# EAGLE design Potencia (EAGLE 9.4.2)
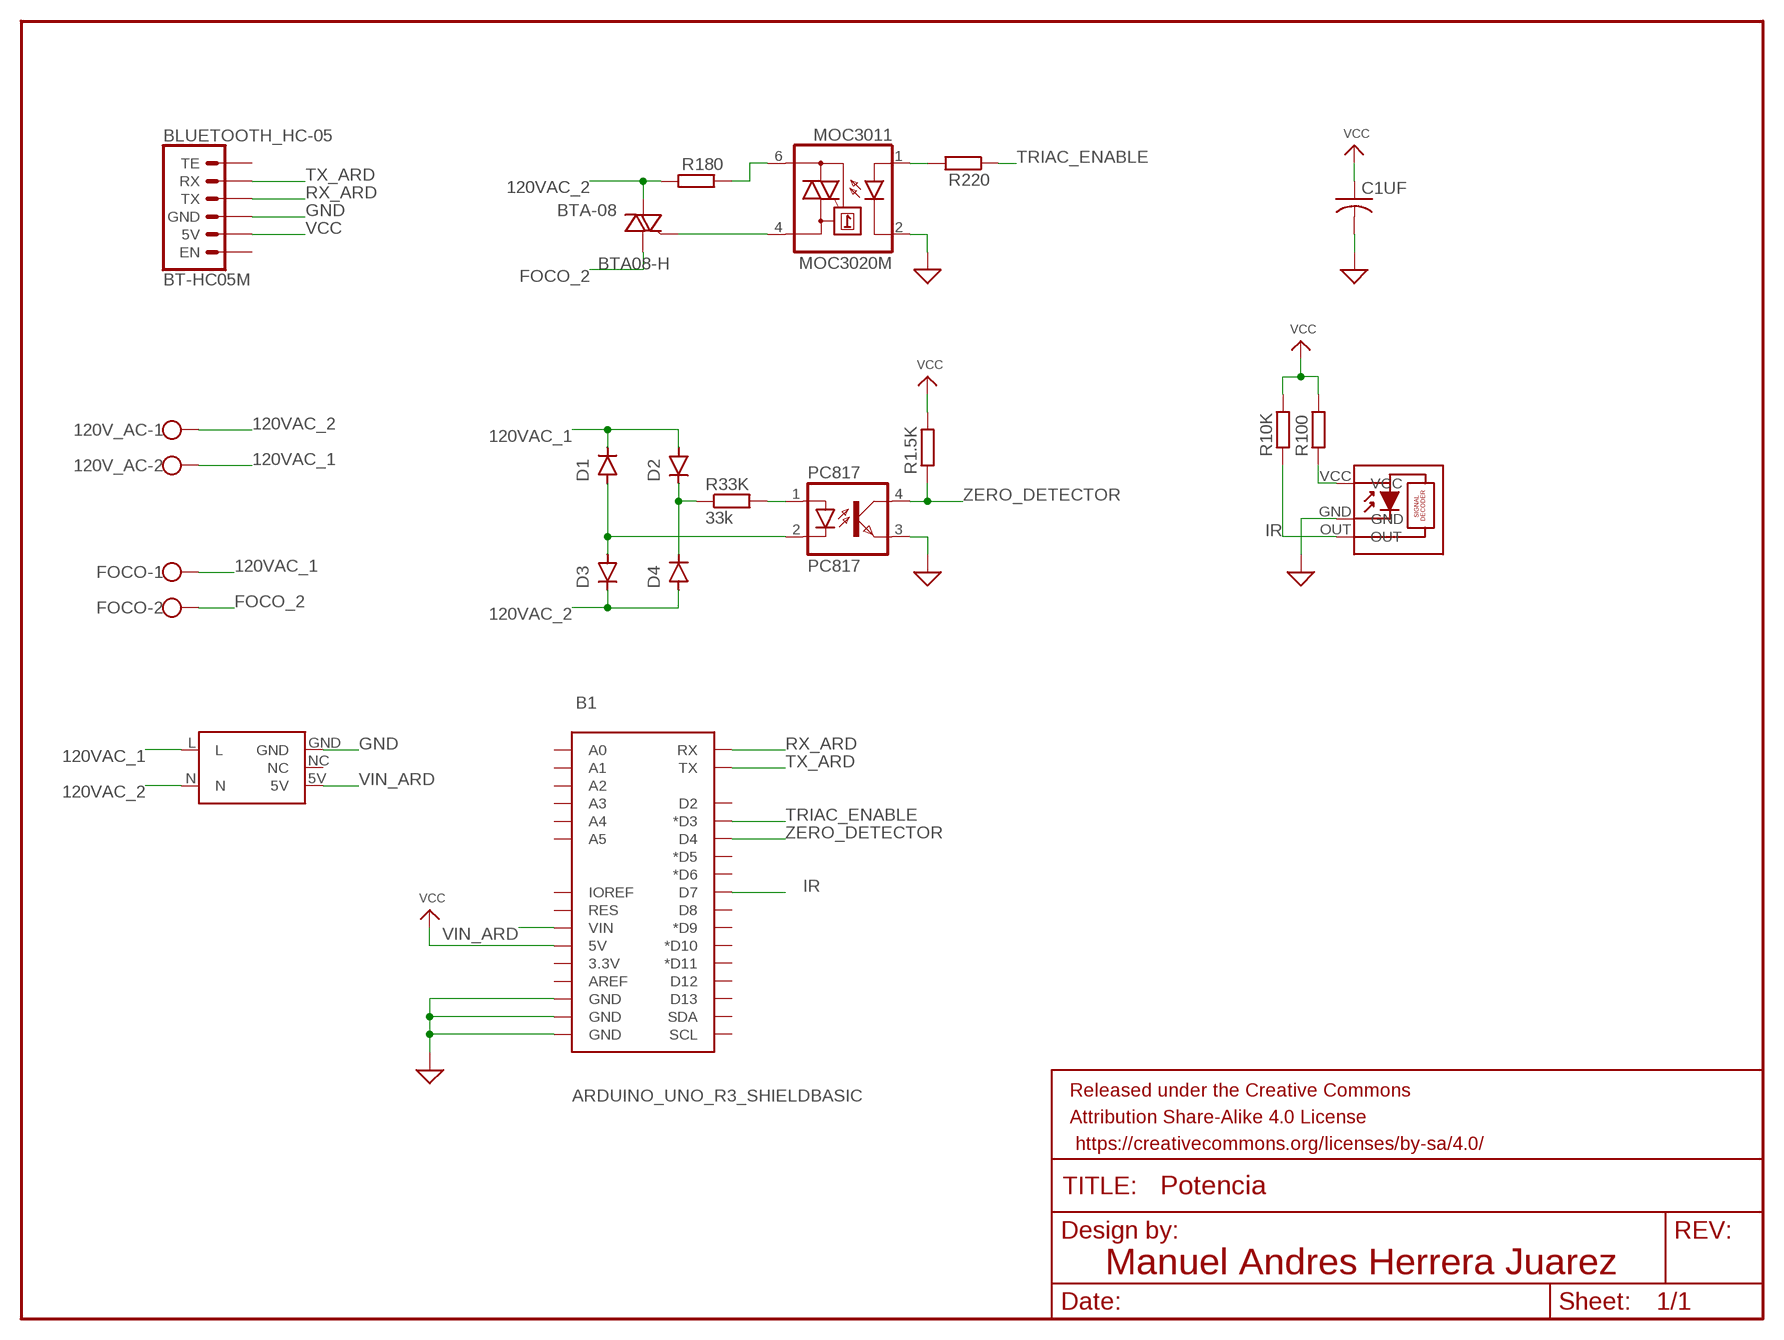
[diagram p0: schematic, sheet 1]

## Parts
120V_AC  W237-102  [W237-102]
B1  ARDUINO_UNO_R3_SHIELDBASIC  [UNO_R3_SHIELD]
BLUETOOTH_HC-05  BT-HC05M  [HEADER1X6]
BTA-08  BTA08-H  [TO220BH]
C1UF  C-USC1206  [C1206]
D1  1N4007  [DO-41]
D2  1N4007  [DO-41]
D3  1N4007  [DO-41]
D4  1N4007  [DO-41]
FOCO  W237-102  [W237-102]
FRAME2  FRAME-LETTERNO_PACKAGE  [DUMMY]
IR1838  VS138  [TO92-BCE]
MOC3011  MOC3020M  [DIL06]
PC817  PC817  [DIL04]
R1.5K  R-EU_0207/10  [0207/10]
R10K  R-EU_0207/10  [0207/10]
R33K  33k  R-EU_0411/15  [0411/15]
R100  R-EU_0207/10  [0207/10]
R180  R-EU_0204/7  [0204/7]
R220  R-EU_0207/10  [0207/10]
U$1  127VAC_5VDC_CONVERTER  [127AC_5DC_CONVERTER]

## Nets
120VAC_1: 120V_AC.2 D1.C D2.A FOCO.1 U$1.L
120VAC_2: 120V_AC.1 BTA-08.T2(A2) D3.C D4.A R180.2 U$1.N
FOCO_2: BTA-08.T1(A1) FOCO.2
GND: B1.GND@0(GND) B1.GND@1(GND) B1.GND@2(GND) BLUETOOTH_HC-05.P$4(GND) C1UF.2 IR1838.GND MOC3011.2(C) PC817.3(EMIT) U$1.GND ; supply symbol labelled SUP
IR: B1.D7 IR1838.OUT R10K.1
N$1: D1.A D3.A PC817.2(C)
N$2: D2.C D4.C R33K.1
N$3: IR1838.VCC R100.1
N$5: PC817.1(A) R33K.2
N$10: BTA-08.G MOC3011.4(A1)
N$12: MOC3011.6(A2) R180.1
N$13: MOC3011.1(A) R220.2
RX_ARD: B1.RX BLUETOOTH_HC-05.P$3(TX)
TRIAC_ENABLE: B1.D3(*D3) R220.1
TX_ARD: B1.TX BLUETOOTH_HC-05.P$2(RX)
VCC: B1.5V BLUETOOTH_HC-05.P$5(5V) C1UF.1 R1.5K.2 R10K.2 R100.2
VIN_ARD: B1.VIN U$1.5V
ZERO_DETECTOR: B1.D4 PC817.4(COL) R1.5K.1
Unconnected: B1.3.3V B1.A0 B1.A1 B1.A2 B1.A3 B1.A4 B1.A5 B1.AREF B1.D2 B1.D5(*D5) B1.D6(*D6) B1.D8 B1.D9(*D9) B1.D10(*D10) B1.D11(*D11) B1.D12 B1.D13 B1.IOREF B1.RES B1.SCL B1.SDA BLUETOOTH_HC-05.P$1(TE) BLUETOOTH_HC-05.P$6(EN) U$1.NC

## Notes on the sheet
- Manuel Andres Herrera Juarez

## Library data of the parts
120V_AC FOCO = con-wago-500:W237-102: WAGO SCREW CLAMP; MPN: 237-102; OC_FARNELL: unknown; OC_NEWARK: 70K9898
B1 = SparkFun-Boards:ARDUINO_UNO_R3_SHIELD: Arduino R3 Shield Footprint Shield form compatible with the Arduino Uno R3. SparkFun Products: MG2639 Cellular Shield <https://www.sparkfun.com/products/13120> MIDI Shield <https://www.sparkfun.com/products/12898> R3 Stackable Headers Kit <https://www.sparkfun.com/products/11417>
BLUETOOTH_HC-05 = MyLibrary:BT-HC05M
BTA-08 = MyLibrary:BTA08: TRIAC Source: http://www.semiconductors.philips.com BT138_SERIES_2.pdf
C1UF = rcl:C-US: CAPACITOR, American symbol; SPICEPREFIX: C
D1-D4 = Diodes:1N4007: DIODE GEN PURP 1KV 1A DO41 Manufacturer's datasheet <https://www.mccsemi.com/pdf/Products/1N4001-1N4007(DO-41).pdf>; CREATED_BY: PCBLayout.com; DIGIKEY_PART_NUMBER: 1N4007MSCT-ND; MANUFACTURER: Micro Commercial Co; MPN: 1N4007; PACKAGE: DO-41
FRAME2 = SparkFun-Aesthetics:FRAME-LETTER: Schematic Frame - Letter Standard 8.5x11 US Letter frame; DESIGNER: Nobody; VERSION: v01
IR1838 = MyLibrary:VS138
MOC3011 = optocoupler:MOC30*M: RANDOM-PHASE OPTOISOLATORS TRIAC DRIVER OUTPUT Source: http://www.fairchildsemi.com MOC3020-M.pdf; MF: FAIRCHILD SEMICONDUCTOR; MPN: MOC3020-M; OC_FARNELL: 1505425; OC_NEWARK: 72K8895
PC817 = optocoupler:PC817: SHARP OPTO COUPLER; MPN: PC817X4J000F; OC_FARNELL: 9707727; OC_NEWARK: 97K7059
R1.5K R10K R33K R100 = resistor:R-EU_: RESISTOR, European symbol
R180 R220 = rcl:R-EU_: RESISTOR, European symbol; SPICEPREFIX: R
U$1 = MyLibrary:127VAC_5VDC_CONVERTER

## Board
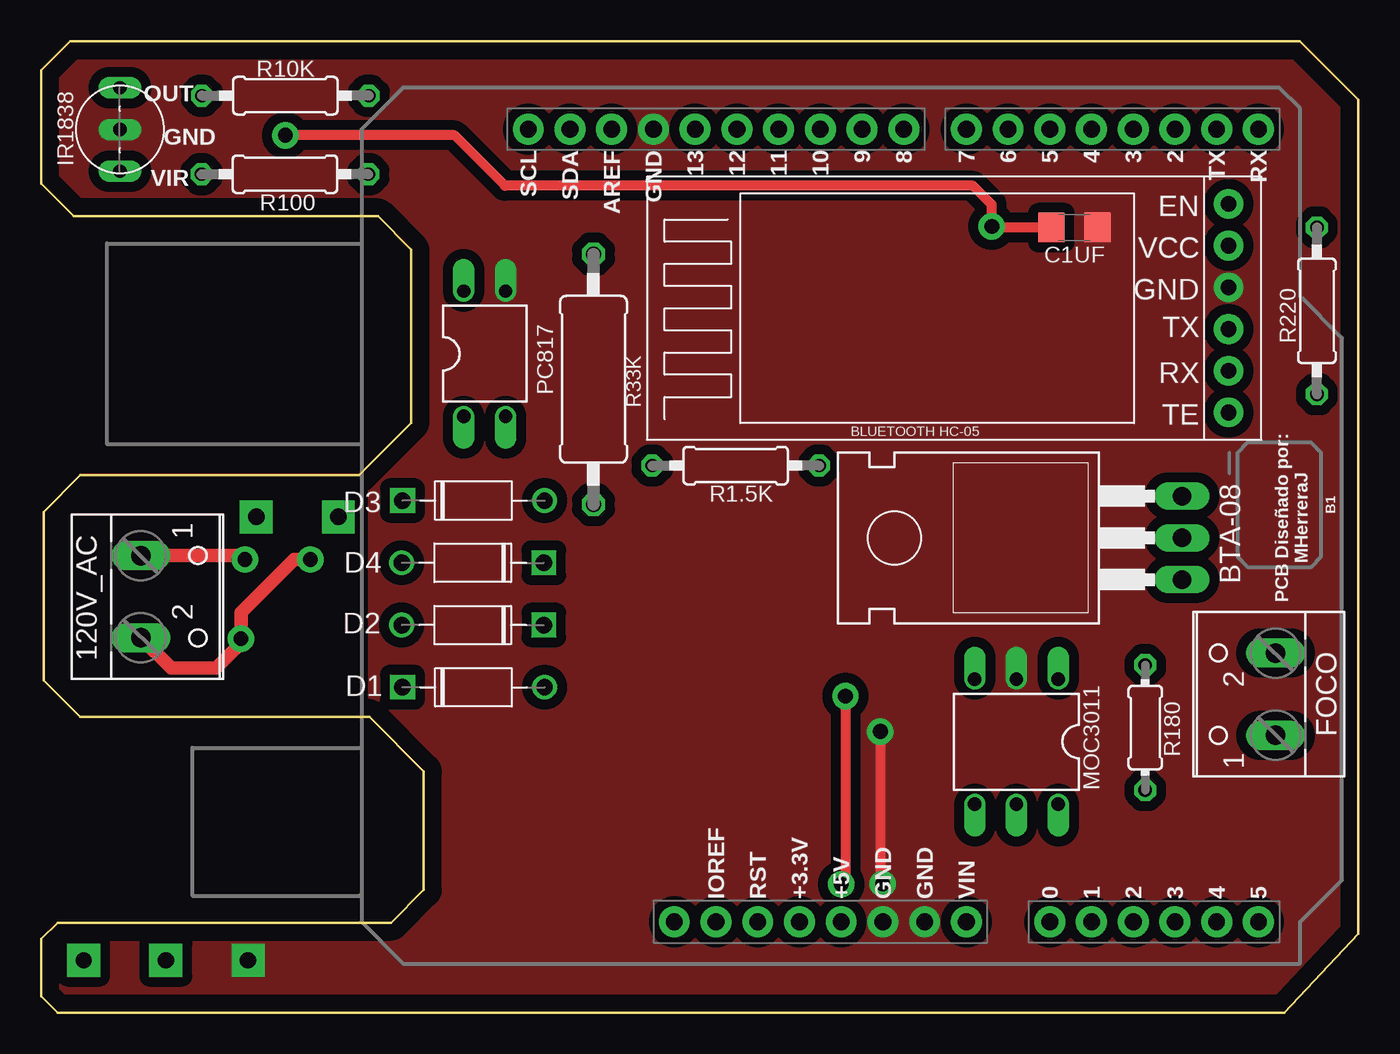
[diagram p1: board, top side]
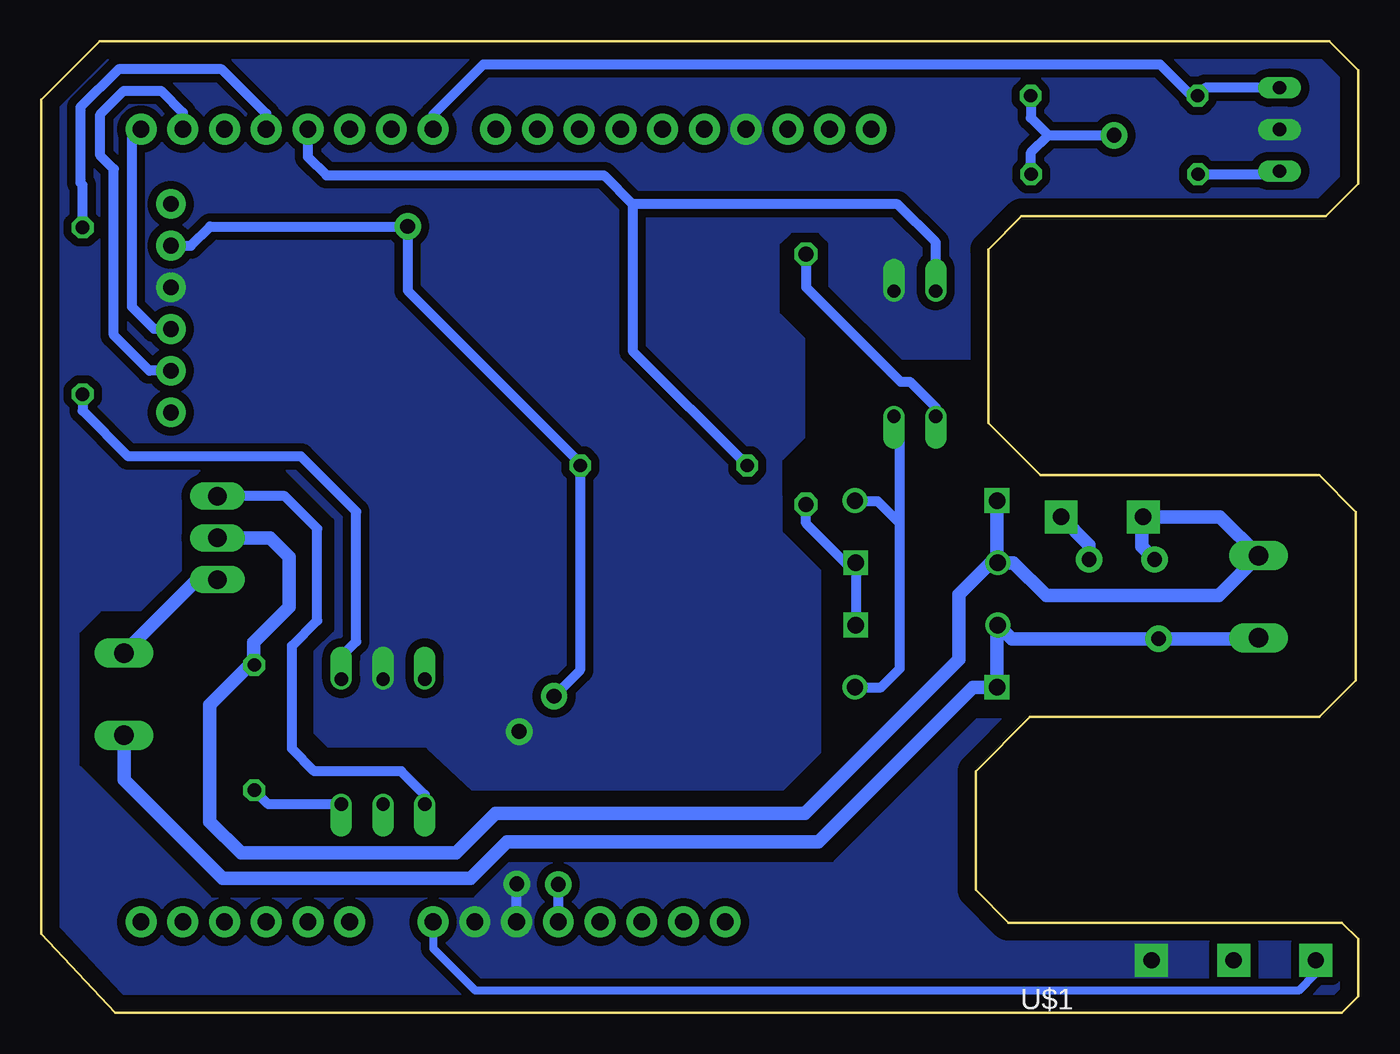
[diagram p2: board, bottom side, seen from below]

Size 80.2 x 59.17 mm. Coordinates in mm from the lower left corner, seen from the top.
Outline: 20.51,48.5 2,48.5 0,50.5 0,57.38 1.79,59.17 76.64,59.17 80.2,55.61 80.2,4.81 75.69,0 1,0 0,1 0,4.5 1,5.5 21.32,5.5 23.3,7.48 23.3,14.72 20,18.02 2.38,18.02 0.15,20.25 0.15,30.51 2.39,32.75 19.36,32.75 22.54,35.92 22.54,46.47 20.51,48.5
Copper layers (1*16): Top 0.035mm / dielectric 1.5mm / Bottom 0.035mm
Design rules "default": minimum track width 6mil, minimum drill 0.35mm, track to track 6mil, track to pad 6mil, pad to pad 6mil, via to via 6mil, smd to smd 6mil, copper to edge 40mil, drill to drill 6mil, minimum pad ring 10mil, minimum via ring 8mil, stop-mask expansion 4mil, vias tented up to drill 0mil, thermal gap 10mil

### Footprints (pad centres in the part's own frame; a part is rotated, then mirrored left to right if it is on the bottom)
W237-102 = drill 1.194 long: 1 -2.5,-1.27; 2 2.5,-1.27
UNO_R3_SHIELD = drill 1.016 pad 1.88: 3.3V 24.13,-2.54; 5V 24.13,0; A0 24.13,12.7; A1 24.13,15.24; A2 24.13,17.78; A3 24.13,20.32; A4 24.13,22.86; A5 24.13,25.4; AREF -24.13,-13.97; D2 -24.13,20.32; D3 -24.13,17.78; D4 -24.13,15.24; D5 -24.13,12.7; D6 -24.13,10.16; D7 -24.13,7.62; D8 -24.13,3.81; D9 -24.13,1.27; D10 -24.13,-1.27; D11 -24.13,-3.81; D12 -24.13,-6.35; D13 -24.13,-8.89; GND@0 24.13,2.54; GND@1 24.13,5.08; GND@2 -24.13,-11.43; IOREF 24.13,-7.62; NC 24.13,-10.16; RES 24.13,-5.08; RX -24.13,25.4; SCL -24.13,-19.05; SDA -24.13,-16.51; TX -24.13,22.86; VIN 24.13,7.62
HEADER1X6 = drill 0.95 pad 1.8: P$1 0,6.35; P$2 0,3.81; P$3 0,1.27; P$4 0,-1.27; P$5 0,-3.81; P$6 0,-6.35
TO220BH = drill 1.118 long: G 2.54,-6.35; T1 -2.54,-6.35; T2 0,-6.35
C1206 = smd 1.6 x 1.8: 1 -1.4,0; 2 1.4,0
DO-41 = drill 1: A 4.325,0 | drill 1 square: C -4.325,0
TO92-BCE = drill 0.813 long: GND 0,0; OUT -2.54,0; VCC 2.54,0
DIL06 = drill 0.813 offset: 1 -2.54,-3.81; 2 0,-3.81; 3 2.54,-3.81; 4 2.54,3.81; 5 0,3.81; 6 -2.54,3.81
DIL04 = drill 0.813 offset: 1 -1.27,-3.81; 2 1.27,-3.81; 3 1.27,3.81; 4 -1.27,3.81
0207/10 = drill 0.813 octagon: 1 -5.08,0; 2 5.08,0
0411/15 = drill 0.914 octagon: 1 -7.62,0; 2 7.62,0
0204/7 = drill 0.813 octagon: 1 -3.81,0; 2 3.81,0
127AC_5DC_CONVERTER = drill 1 pad 2 square: 5V 8,13.5; GND -2,13.5; L -7.5,-13.5; N -2.5,-13.5; NC 3,13.5

### Placement (x,y rotation side)
120V_AC  7.34,25.34 270 top
B1  48.71,29.67 270 top
BLUETOOTH_HC-05  72.3,42.9 180 top
BTA-08  63.12,28.92 90 top
C1UF  62.91,47.82 0 top
D1  26.33,19.83 0 top
D2  26.28,23.62 180 top
D3  26.33,31.19 0 top
D4  26.28,27.41 180 top
FOCO  73.88,19.4 90 top
FRAME2  5.5,13.18 0 top
IR1838  4.8,53.79 270 top
MOC3011  59.38,16.51 180 top
PC817  27,40.13 0 top
R1.5K  42.28,33.32 0 top
R10K  14.87,55.84 0 top
R33K  33.63,38.58 90 top
R100  14.85,51.06 0 top
R180  67.22,17.37 90 top
R220  77.67,42.74 270 top
U$1  10.6,16.7 180 top

### Tracks (layer width: path | path; a pad name or v marks a point on that pad's centre or on a via)
120VAC_1  (via drill 0.9 pad 1.6)
  Top 0.813: v16.4,27.6 15.4,27.6 12.18,24.38 v12.18,22.79 v12.17,22.78 12.17,22.52 10.65,21 7.91,21 120V_AC.2
  Bottom 0.813: FOCO.1 75.15,14.2 69.16,8.21 54.04,8.21 51.83,10.42 32.87,10.42 23.46,19.83 D1.C 22,23.57 D2.A 21.09,22.76 12.19,22.76 v12.17,22.78 6.13,22.78 120V_AC.2 | U$1.L 16.4,28.5 v16.4,27.6
120VAC_2  (via drill 0.9 pad 1.6)
  Top 0.813: 120V_AC.1 12.17,27.84 v12.41,27.6
  Bottom 0.813: D3.C 22,27.45 D4.A | D4.A 22.39,27.41 24.33,25.47 24.33,21.52 33.7,12.14 52.52,12.14 54.93,9.73 68.01,9.73 69.92,11.64 69.92,18.75 67.48,21.18 R180.2 67.25,21.21 67.25,22.56 65.09,24.72 65.09,27.77 66.25,28.92 BTA-08.T2 | D4.A 21,27.41 19,25.41 8.51,25.41 120V_AC.1 8.43,30.2 U$1.N 13.2,30.2 13.2,28.39 v12.41,27.6
FOCO_2
  Bottom 0.813: BTA-08.T1 70.71,26.38 75.15,21.94 FOCO.2
GND  (via drill 0.9 pad 1.6)
  Top 0.61: v51.09,17.13 51.09,8.01 v51.24,7.86
  Bottom 0.61: B1.GND@0 v51.25,7.85 v51.24,7.86
  pour Top (isolate 0.61, no thermals): 75.29,-0.1 1.3,-0.1 0,1.2 0,4.5 1,5.5 22.2,5.5 23.3,6.6 23.3,14.71 19.99,18.02 1.78,18.02 0.11,19.7 0.11,31.07 1.78,32.75 19.36,32.75 22.54,35.93 22.54,46.46 20.5,48.5 1.78,48.5 0.09,50.19 0.09,56.71 2.53,59.15 76.65,59.15 80.2,55.61 80.2,4.81
  pour Bottom (isolate 0.5, no thermals): 75.16,0.03 1.17,0.03 0,1.2 0,4.5 0.98,5.48 22,5.48 23.31,6.43 23.27,14.74 19.86,18.14 1.66,18.14 0.18,19.62 0.18,30.9 2.16,32.88 19.46,32.88 22.53,35.95 22.53,46.47 20.38,48.62 1.66,48.62 0.04,50.24 0.04,56.42 2.85,59.22 76.59,59.22 80.07,55.74 80.07,4.94
IR
  Bottom 0.61: B1.D7 56.33,54.69 53.26,57.76 12.09,57.76 10.29,55.96 9.68,55.96 | IR1838.OUT 9.31,56.33 9.68,55.96 | 9.68,55.96 R10K.1
N$1
  Bottom 0.61: D1.A 29.06,19.83 27.94,20.95 27.94,29.83 | PC817.2 27.94,35.99 27.94,29.83 | D3.A 30.62,31.16 29.27,31.16 27.94,29.83
N$2
  Bottom 0.61: D2.C D4.C 31.24,27.41 33.63,29.8 R33K.1
N$3
  Bottom 0.61: R100.1 4.98,51.06 IR1838.VCC
N$5
  Bottom 0.61: R33K.2 33.63,44.19 27.88,38.44 27.31,38.44 25.73,36.86 PC817.1
N$10
  Bottom 0.61: MOC3011.4 56.84,13.29 58.27,14.72 63.57,14.72 64.93,16.07 64.93,22.34 63.39,23.88 63.39,29.49 65.36,31.46 BTA-08.G
N$12
  Bottom 0.61: MOC3011.6 66.36,12.7 R180.1
N$13
  Bottom 0.61: MOC3011.1 61.92,21.7 61.01,22.61 61.01,30.51 64.38,33.88 74.88,33.88 77.67,36.66 R220.2
NC
  cutout Bottom: 1.78,32.75 0.21,31.17 0.21,19.6 1.78,18.02 23.29,18.02 32.05,9.26 51.75,9.26 53.91,7.1 69.78,7.1 77.78,15.1 77.78,23.1 76.52,24.37 74.1,24.37 71.56,26.91 71.56,31.8 70.41,32.95 65.38,32.95 62.46,30.03 62.46,23.25 63.69,22.02 63.69,17 62.75,16.07 56.79,16.07 53.98,13.45 35.01,13.45 32.62,15.83 32.62,26.97 34.95,29.29 34.97,33.61 33.53,35.04 33.53,41.04 35.14,42.65 35.14,46.76 34.48,47.43 32.91,47.43 32.42,46.94 32.42,44.29 27.75,39.61 23.18,39.61 22.54,38.97 22.54,35.92 19.36,32.75
  cutout Top: 1.81,32.74 0.21,31.13 0.21,19.77 1.98,18 19.81,18 19.81,33.16 19.4,32.74
NC1
  cutout Bottom: 1.78,32.75 0.21,31.17 0.21,19.6 1.78,18.02 23.24,18.02 32.01,9.26 51.75,9.26 53.91,7.1 69.78,7.1 77.78,15.1 77.78,23.1 76.52,24.37 74.03,24.37 71.52,26.87 71.52,31.86 70.51,32.88 65.34,32.88 62.43,29.97 62.43,23.33 63.68,22.08 63.68,17 62.72,16.04 56.76,16.04 53.98,13.45 34.94,13.45 32.62,15.76 32.62,26.99 34.96,29.33 35.01,33.6 33.61,35.01 33.61,41.11 35.15,42.65 35.15,46.72 34.44,47.43 32.94,47.43 32.35,46.84 32.35,44.22 27.8,39.67 23.24,39.67 22.54,38.97 22.54,35.92 19.36,32.75
RX_ARD
  Bottom 0.61: BLUETOOTH_HC-05.P$3 73.32,41.63 74.68,42.99 74.68,53.23 B1.RX
TRIAC_ENABLE
  Bottom 0.61: B1.D3 66.49,54.75 69.19,57.45 75.48,57.45 77.81,55.13 77.81,50.55 77.67,50.41 R220.1
TX_ARD
  Bottom 0.61: B1.TX 71.57,54.82 72.9,56.14 75.16,56.14 76.59,54.71 76.59,52.19 75.77,51.38 75.77,41.27 73.6,39.09 BLUETOOTH_HC-05.P$2
VCC  (via drill 0.9 pad 1.6)
  Top 0.61: v48.71,7.83 48.97,8.09 v48.97,19.28 | v57.88,47.88 57.88,49.22 56.74,50.35 28.24,50.35 25.16,53.43 v14.87,53.43 | 57.88,47.47 v57.88,47.88 | C1UF.1 57.94,47.82 v57.88,47.88
  Bottom 0.61: B1.5V v48.71,7.83 | 71.88,46.3 BLUETOOTH_HC-05.P$5 71.08,46.72 69.91,47.88 v57.88,47.88 | 48.58,19.28 v48.97,19.28 47.39,20.86 47.39,33.49 | 19.68,55.58 R10K.2 19.95,54.5 18.88,53.43 | 14.87,53.84 v14.87,53.43 18.88,53.43 | R100.2 19.93,52.39 18.88,53.43 | v57.88,47.88 57.84,47.91 | v57.88,47.88 57.88,43.98 47.39,33.49 | R1.5K.2 47.36,33.46 47.39,33.49
VIN_ARD
  Bottom 0.5: B1.VIN 56.33,3.93 53.76,1.36 3.64,1.36 2.6,2.4 U$1.5V
ZERO_DETECTOR
  Bottom 0.61: B1.D4 63.95,52.12 62.83,50.99 45.94,50.99 44.18,49.23 | PC817.4 25.73,46.92 28.05,49.23 44.18,49.23 | 44.18,49.23 44.18,40.3 R1.5K.1

### Text on the board
tNames: OUT | GND | VIR | BLUETOOTH HC-05 | PCB Diseñado por: / MHerreraJ